# Altium schematic sheet Microphone.SchDoc: Microphone
size A3; Organization: CU Boulder; DocumentNumber: 005; Revision: 1.1; SheetNumber: 5; SheetTotal: 8
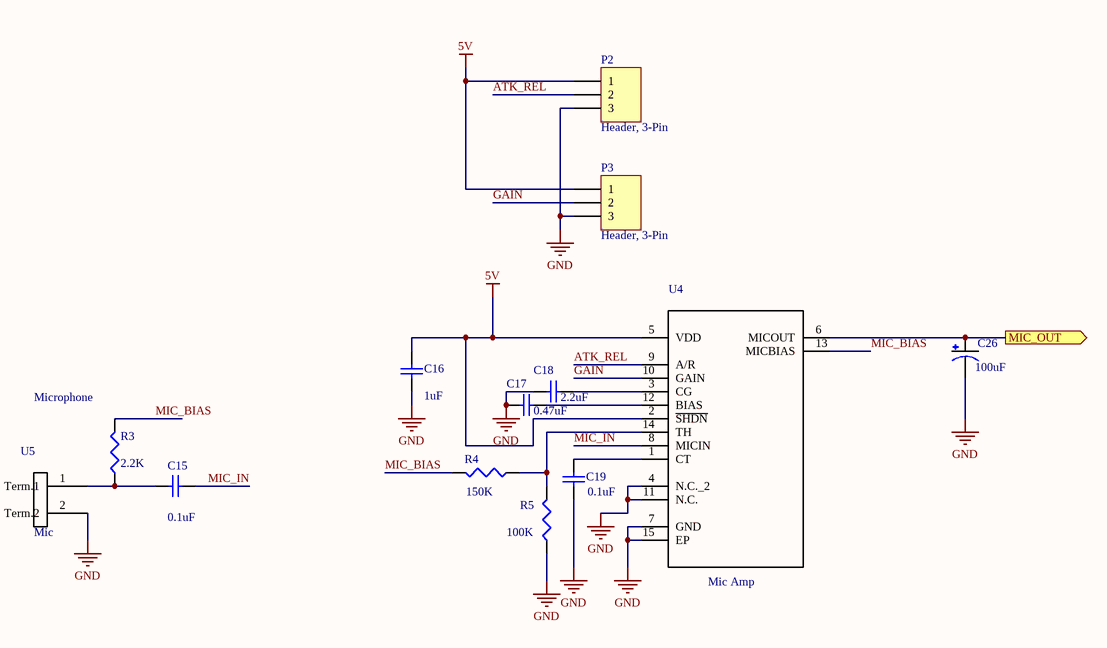
[diagram p0: Microphone.SchDoc]

## Parts
C15  0.1uF  [1608[0603]]
C16  1uF  [1608[0603]]
C17  0.47uF  [1608[0603]]
C18  2.2uF  [1608[0603]]
C19  0.1uF  [1608[0603]]
C26  100uF  [CAPAE1050X1050N]
P2  Header, 3-Pin  [HDR1X3]
P3  Header, 3-Pin  [HDR1X3]
R3  2.2K  [J1-0603]
R4  150K  [J1-0603]
R5  100K  [J1-0603]
U4  Mic Amp  [DFN300X300X80-15N]
U5  Mic  [CMA-4544PF-W]

## Ports
MIC_OUT (out)

## Nets
5V: C16.2 P2.1 P3.1 U4.2(~{SHDN}) U4.5(VDD)
GND: C16.1 C17.2 C18.2 C19.1 C26.2(NEG) P2.3 P3.3 R5.1 U4.4(N.C._2) U4.7(GND) U4.11(N.C.) U4.15(EP) U5.2(Term.2)
ATK_REL: P2.2 U4.9(A/R)
GAIN: P3.2 U4.10(GAIN)
MIC_BIAS: R3.2 R4.2 U4.13(MICBIAS)
MIC_IN: C15.2 U4.8(MICIN)
MIC_OUT: C26.1(POS) U4.6(MICOUT) ; port MIC_OUT
NetC15_1: C15.1 R3.1 U5.1(Term.1)
NetC17_1: C17.1 U4.12(BIAS)
NetC18_1: C18.1 U4.3(CG)
NetC19_2: C19.2 U4.1(CT)
NetR4_1: R4.1 R5.2 U4.14(TH)

## Notes on the sheet
- (near R3) Microphone
- Title
- Size:
- Date:
- A3
- Number:
- Time:
- Revision:
- Sheet
- of
- File:

## Library data of the parts
C15-C19 = Cap Semi: Capacitor (Semiconductor SIM Model); Published: 8-Jun-2000; LatestRevisionDate: 29-May-2009; LatestRevisionNote: IPC-7351 Footprint Added.; PackageReference: C1206; Publisher: Altium Limited; PackageDescription: Chip Capacitor; Supplier 1: Digi-Key
  C15 C19: Value: 0.1uF; Supplier Part Number 1: 311-1088-1-ND
  C16: Value: 1uF; Supplier Part Number 1: 1276-1946-1-ND
  C17: Value: 0.47uF; Supplier Part Number 1: 490-3295-1-ND
  C18: Value: 2.2uF; Supplier Part Number 1: 587-2983-6-ND
C26 = MAL214699103E3: 146 CTI Series 50 V 100 uF 10 x 10 x 10 mm SMT CAN Electrolytic Capacitor; MF: Vishay; Price: 1.31 USD; Package: Radial Vishay; Availability: Good; MP: MAL214699103E3; Value: 100uF; Supplier 1: Digi-Key; Supplier Part Number 1: 4437PHCT-ND
P2 P3 = Header 3: LatestRevisionDate: 17-Jul-2002; LatestRevisionNote: Re-released for DXP Platform.; Publisher: Altium Limited
R3-R5 = Res3: Resistor; Published: 8-Jun-2000; LatestRevisionDate: 29-May-2009; LatestRevisionNote: IPC-7351 Footprint Added.; PackageReference: J1-0603; Publisher: Altium Limited; PackageDescription: Chip Resistor
  R3: Value: 2.2K
  R4: Value: 150K; Supplier 1: Digi-Key; Supplier Part Number 1: 311-1088-1-ND
  R5: Value: 100K; Supplier 1: Digi-Key; Supplier Part Number 1: 311-100KHRCT-ND
U4 = MAX9814ETD+T: Audio Amp Microphone 1-CH Mono Class-AB 14-Pin TDFN EP T/R; MF: Maxim Integrated; Price: 0.92 USD; MP: MAX9814ETD+T; Package: TDFN-14 Maxim Integrated; Availability: Good; Value: *; Supplier 1: Digi-Key; Supplier Part Number 1: MAX9814ETD+TDKR-ND
U5 = Component_1: Supplier 1: Digi-Key; Supplier Part Number 1: 102-1721-ND